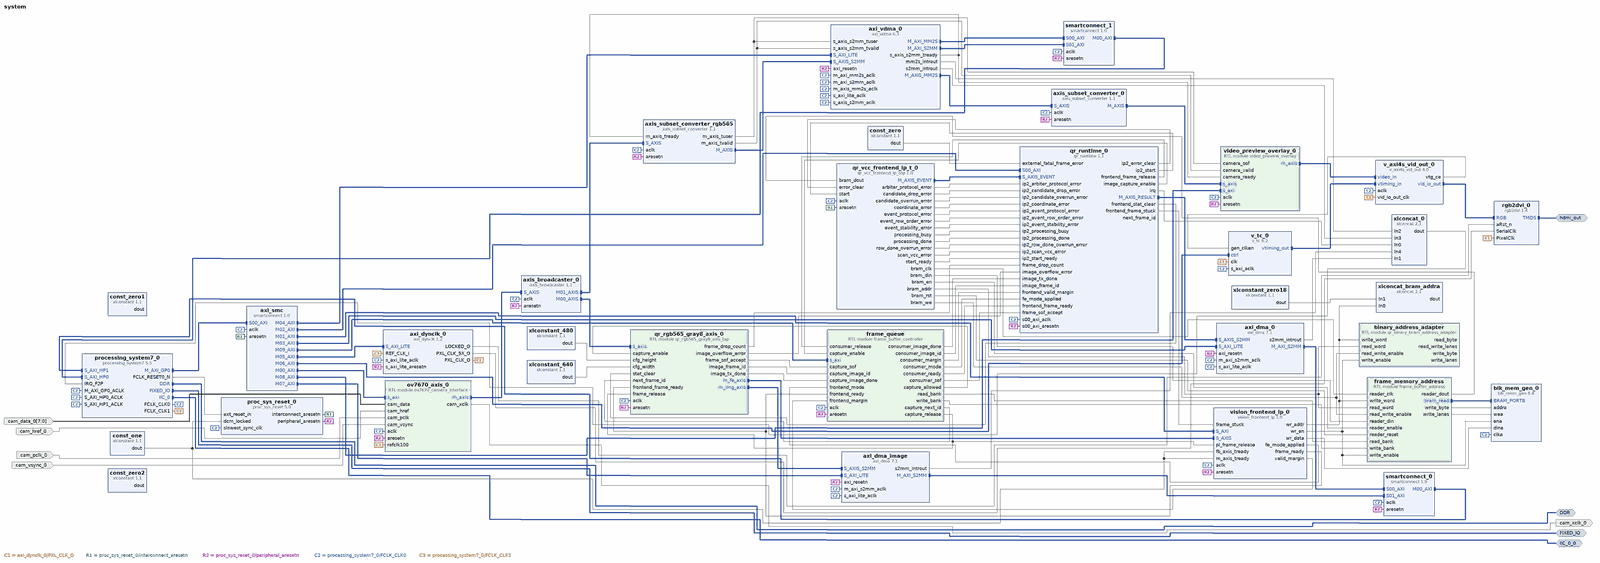
[diagram p0: block diagram of the top level, whole]
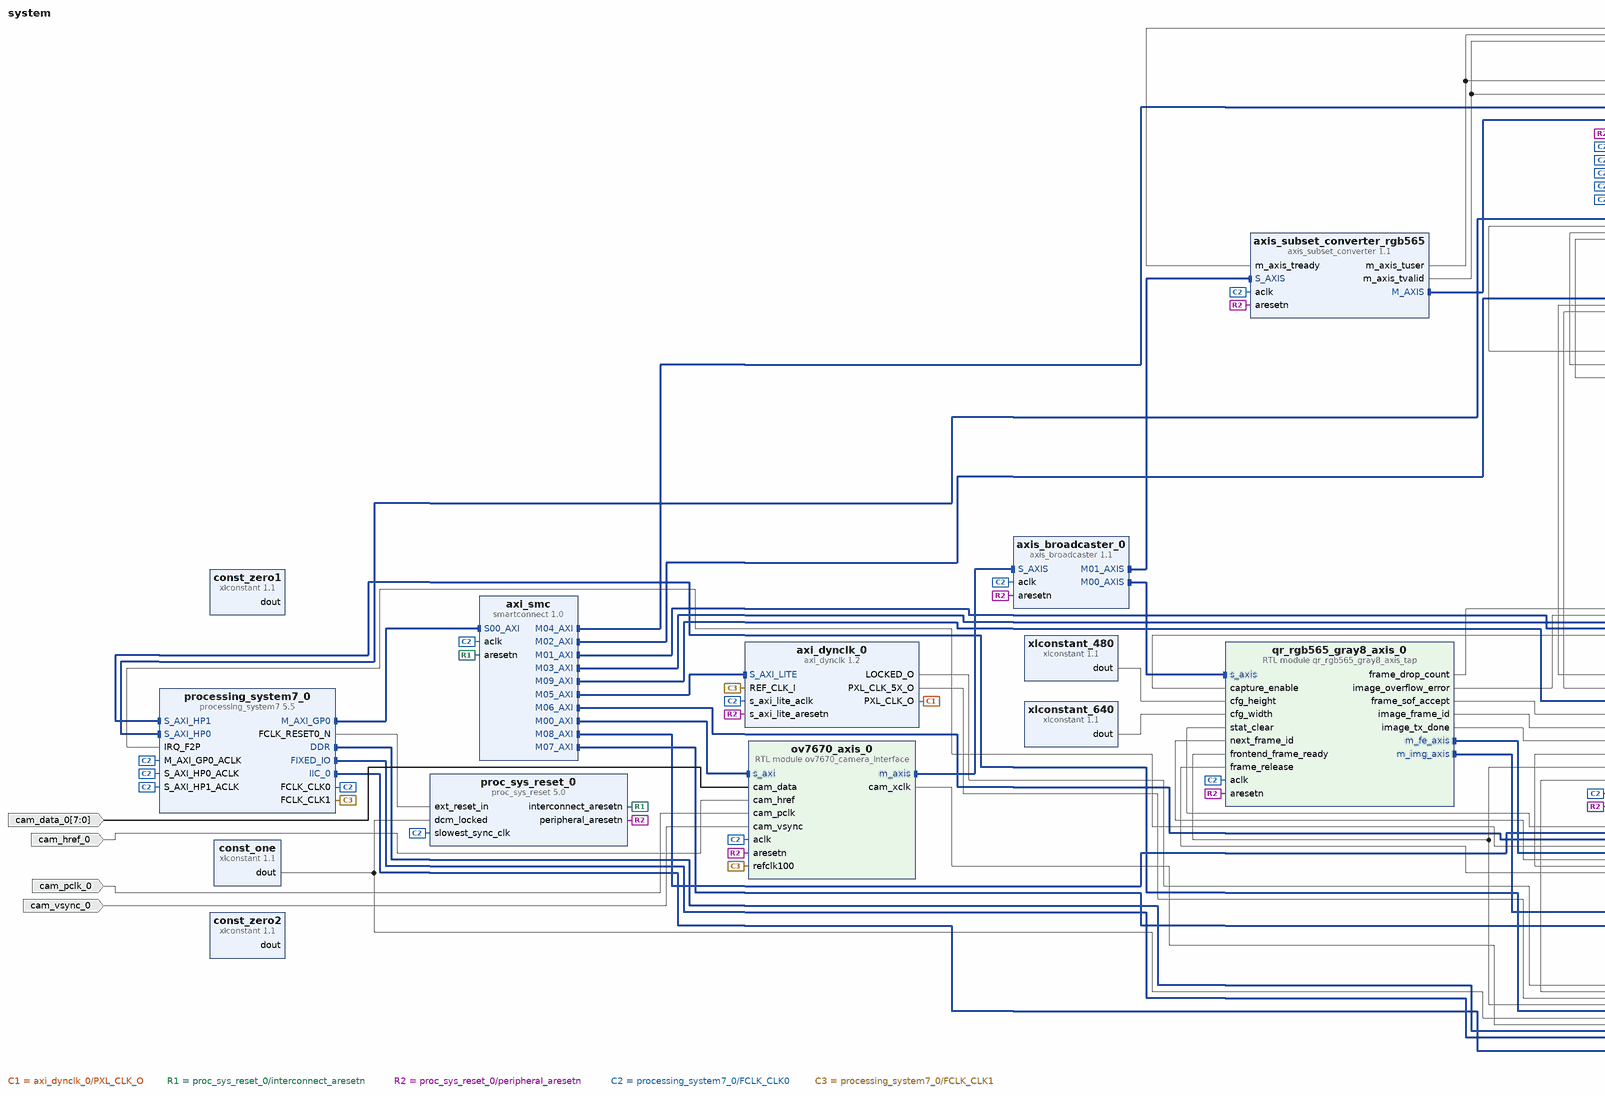
[diagram p1: block diagram of the top level, left part]
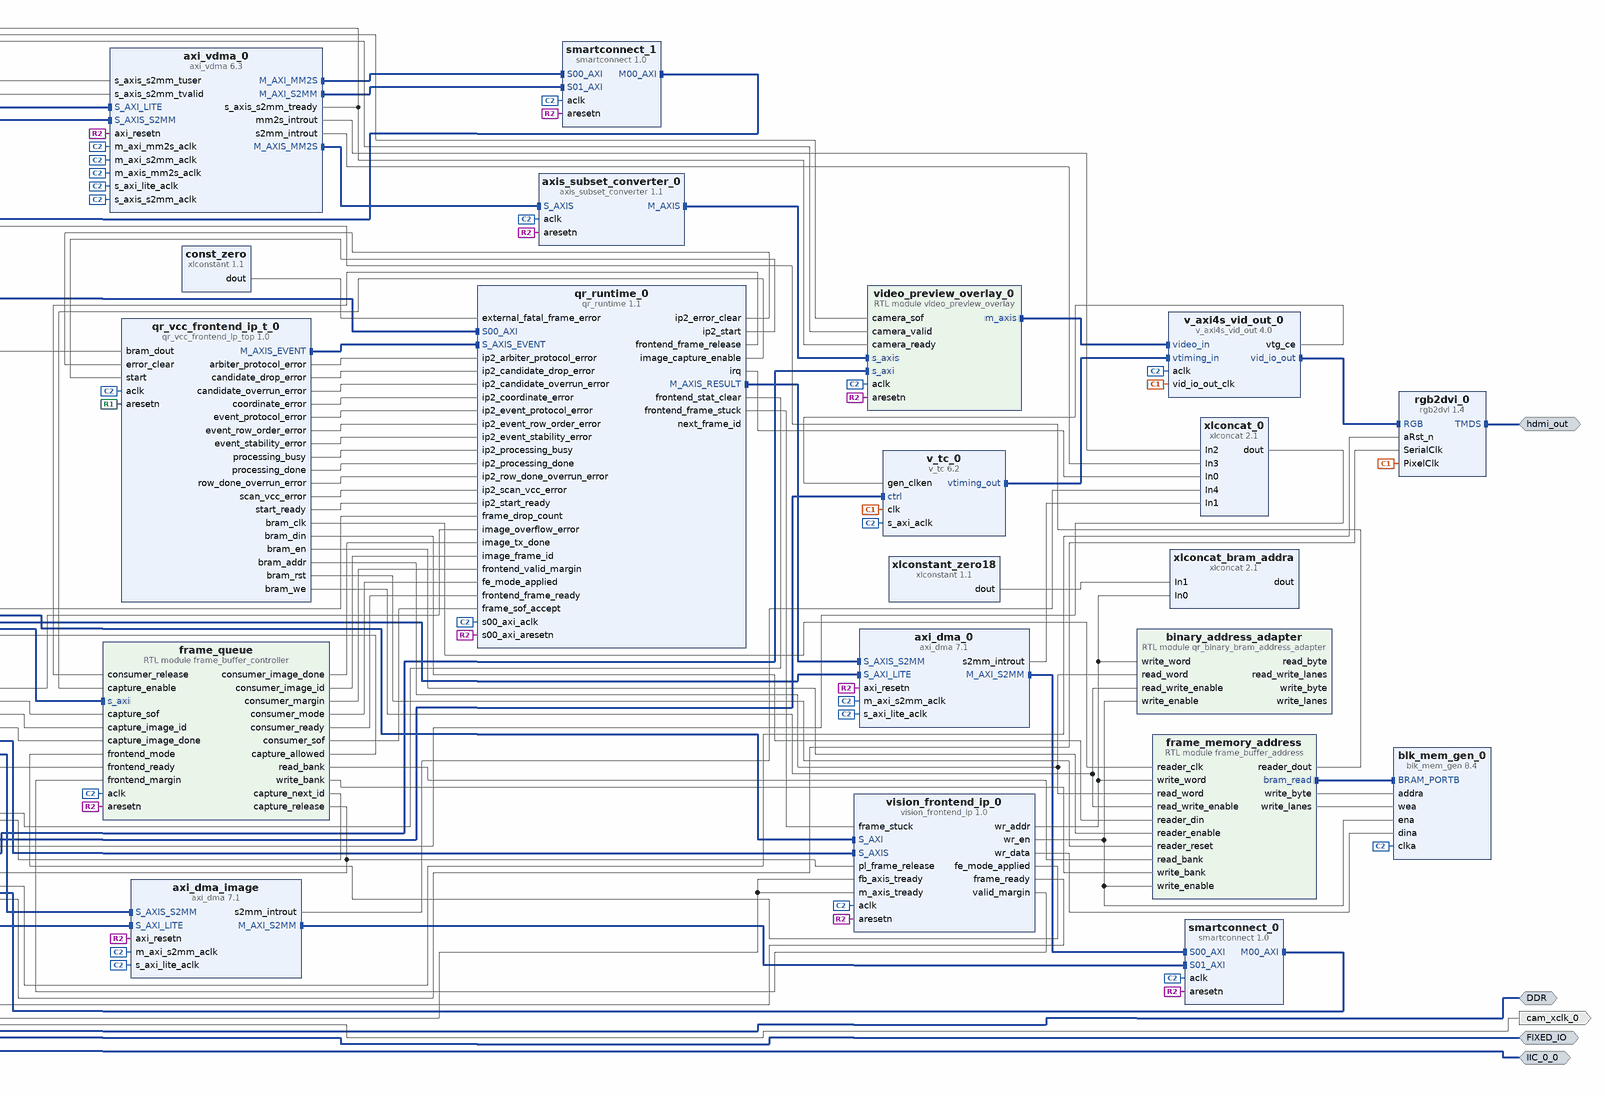
[diagram p2: block diagram of the top level, right part]
# Vivado block design system, xc7z020clg400-1, Vivado 2024.2
create_bd_design system

create_bd_intf_port -mode Master -vlnv xilinx.com:interface:ddrx_rtl:1.0 DDR
create_bd_intf_port -mode Master -vlnv xilinx.com:display_processing_system7:fixedio_rtl:1.0 FIXED_IO
create_bd_intf_port -mode Master -vlnv xilinx.com:interface:iic_rtl:1.0 IIC_0_0
create_bd_intf_port -mode Master -vlnv digilentinc.com:interface:tmds_rtl:1.0 hdmi_out
create_bd_port -dir I cam_pclk_0
create_bd_port -dir I cam_href_0
create_bd_port -dir I cam_vsync_0
create_bd_port -dir I -from 7 -to 0 cam_data_0
create_bd_port -dir O cam_xclk_0

create_bd_cell -type ip -vlnv xilinx.com:ip:processing_system7:5.5 processing_system7_0
set_property -dict [list \
  CONFIG.PCW_APU_PERIPHERAL_FREQMHZ 666.666666 \
  CONFIG.PCW_ENET0_ENET0_IO {MIO 16 .. 27} \
  CONFIG.PCW_ENET0_GRP_MDIO_ENABLE 1 \
  CONFIG.PCW_ENET0_GRP_MDIO_IO {MIO 52 .. 53} \
  CONFIG.PCW_ENET0_PERIPHERAL_ENABLE 1 \
  CONFIG.PCW_ENET0_RESET_ENABLE 0 \
  CONFIG.PCW_ENET_RESET_ENABLE 1 \
  CONFIG.PCW_ENET_RESET_SELECT {Share reset pin} \
  CONFIG.PCW_EN_CLK1_PORT 1 \
  CONFIG.PCW_FCLK_CLK1_BUF TRUE \
  CONFIG.PCW_FPGA0_PERIPHERAL_FREQMHZ 62.500000 \
  CONFIG.PCW_FPGA1_PERIPHERAL_FREQMHZ 100.000000 \
  CONFIG.PCW_FPGA_FCLK1_ENABLE 1 \
  CONFIG.PCW_GPIO_MIO_GPIO_ENABLE 1 \
  CONFIG.PCW_GPIO_MIO_GPIO_IO MIO \
  CONFIG.PCW_I2C0_I2C0_IO EMIO \
  CONFIG.PCW_I2C0_PERIPHERAL_ENABLE 1 \
  CONFIG.PCW_I2C_PERIPHERAL_FREQMHZ 111.111115 \
  CONFIG.PCW_I2C_RESET_ENABLE 1 \
  CONFIG.PCW_I2C_RESET_SELECT {Share reset pin} \
  CONFIG.PCW_IRQ_F2P_INTR 1 \
  CONFIG.PCW_PRESET_BANK1_VOLTAGE {LVCMOS 1.8V} \
  CONFIG.PCW_QSPI_GRP_FBCLK_ENABLE 1 \
  CONFIG.PCW_QSPI_GRP_FBCLK_IO {MIO 8} \
  CONFIG.PCW_QSPI_GRP_SINGLE_SS_ENABLE 1 \
  CONFIG.PCW_QSPI_GRP_SINGLE_SS_IO {MIO 1 .. 6} \
  CONFIG.PCW_QSPI_PERIPHERAL_ENABLE 1 \
  CONFIG.PCW_QSPI_QSPI_IO {MIO 1 .. 6} \
  CONFIG.PCW_SD0_GRP_CD_ENABLE 1 \
  CONFIG.PCW_SD0_GRP_CD_IO {MIO 47} \
  CONFIG.PCW_SD0_GRP_WP_ENABLE 0 \
  CONFIG.PCW_SD0_PERIPHERAL_ENABLE 1 \
  CONFIG.PCW_SD0_SD0_IO {MIO 40 .. 45} \
  CONFIG.PCW_SDIO_PERIPHERAL_FREQMHZ 50 \
  CONFIG.PCW_SINGLE_QSPI_DATA_MODE x4 \
  CONFIG.PCW_UART1_PERIPHERAL_ENABLE 1 \
  CONFIG.PCW_UART1_UART1_IO {MIO 48 .. 49} \
  CONFIG.PCW_UART_PERIPHERAL_FREQMHZ 100 \
  CONFIG.PCW_UIPARAM_DDR_FREQ_MHZ 533.333333 \
  CONFIG.PCW_UIPARAM_DDR_MEMORY_TYPE {DDR 3 (Low Voltage)} \
  CONFIG.PCW_UIPARAM_DDR_PARTNO {MT41K256M16 RE-125} \
  CONFIG.PCW_USB0_PERIPHERAL_ENABLE 1 \
  CONFIG.PCW_USB0_RESET_ENABLE 1 \
  CONFIG.PCW_USB0_RESET_IO {MIO 46} \
  CONFIG.PCW_USB0_USB0_IO {MIO 28 .. 39} \
  CONFIG.PCW_USB_RESET_ENABLE 1 \
  CONFIG.PCW_USB_RESET_SELECT {Share reset pin} \
  CONFIG.PCW_USE_FABRIC_INTERRUPT 1 \
  CONFIG.PCW_USE_S_AXI_HP0 1 \
  CONFIG.PCW_USE_S_AXI_HP1 1 \
] [get_bd_cells processing_system7_0]
# 299 more settings of processing_system7_0 are not shown: defaults, MIO pin electricals, DDR timing, and values the tool derives
create_bd_cell -type ip -vlnv xilinx.com:ip:smartconnect:1.0 axi_smc
set_property -dict {CONFIG.NUM_CLKS 1 CONFIG.NUM_MI 10 CONFIG.NUM_SI 1} [get_bd_cells axi_smc]
create_bd_cell -type ip -vlnv xilinx.com:ip:proc_sys_reset:5.0 proc_sys_reset_0
create_bd_cell -type ip -vlnv xilinx.com:user:vision_frontend_ip:1.0 vision_frontend_ip_0
create_bd_cell -type ip -vlnv xilinx.com:ip:xlconstant:1.1 const_one
set_property -dict {CONFIG.CONST_VAL 1 CONFIG.CONST_WIDTH 1} [get_bd_cells const_one]
create_bd_cell -type ip -vlnv xilinx.com:ip:xlconstant:1.1 const_zero
set_property -dict {CONFIG.CONST_VAL 0 CONFIG.CONST_WIDTH 1} [get_bd_cells const_zero]
create_bd_cell -type ip -vlnv xilinx.com:ip:blk_mem_gen:8.4 blk_mem_gen_0
set_property -dict [list \
  CONFIG.Assume_Synchronous_Clk true \
  CONFIG.Enable_32bit_Address true \
  CONFIG.Memory_Type True_Dual_Port_RAM \
  CONFIG.Read_Width_A 32 \
  CONFIG.Read_Width_B 32 \
  CONFIG.Register_PortA_Output_of_Memory_Core false \
  CONFIG.Register_PortA_Output_of_Memory_Primitives false \
  CONFIG.Register_PortB_Output_of_Memory_Core false \
  CONFIG.Register_PortB_Output_of_Memory_Primitives false \
  CONFIG.Use_RSTA_Pin true \
  CONFIG.Use_RSTB_Pin true \
  CONFIG.Write_Width_A 32 \
  CONFIG.Write_Width_B 32 \
  CONFIG.use_bram_block BRAM_Controller \
] [get_bd_cells blk_mem_gen_0]
create_bd_cell -type ip -vlnv user.org:user:qr_vcc_frontend_ip_top:1.0 qr_vcc_frontend_ip_t_0
create_bd_cell -type ip -vlnv xilinx.com:ip:xlconcat:2.1 xlconcat_0
set_property -dict {CONFIG.IN0_WIDTH 1 CONFIG.NUM_PORTS 5} [get_bd_cells xlconcat_0]
create_bd_cell -type ip -vlnv xilinx.com:ip:xlconcat:2.1 xlconcat_bram_addra
set_property -dict {CONFIG.IN0_WIDTH 14 CONFIG.IN1_WIDTH 18 CONFIG.NUM_PORTS 2} [get_bd_cells xlconcat_bram_addra]
create_bd_cell -type ip -vlnv xilinx.com:ip:xlconstant:1.1 xlconstant_zero18
set_property -dict {CONFIG.CONST_VAL 0 CONFIG.CONST_WIDTH 18} [get_bd_cells xlconstant_zero18]
create_bd_cell -type ip -vlnv xilinx.com:ip:axi_dma:7.1 axi_dma_0
set_property -dict {CONFIG.c_include_mm2s 0 CONFIG.c_include_sg 0} [get_bd_cells axi_dma_0]
create_bd_cell -type ip -vlnv xilinx.com:ip:smartconnect:1.0 smartconnect_0
set_property -dict {CONFIG.NUM_SI 2} [get_bd_cells smartconnect_0]
create_bd_cell -type ip -vlnv xilinx.com:ip:axi_vdma:6.3 axi_vdma_0
set_property -dict [list \
  CONFIG.c_m_axis_mm2s_tdata_width 24 \
  CONFIG.c_mm2s_linebuffer_depth 2048 \
  CONFIG.c_mm2s_max_burst_length 32 \
  CONFIG.c_num_fstores 4 \
  CONFIG.c_s2mm_linebuffer_depth 2048 \
  CONFIG.c_s2mm_max_burst_length 32 \
] [get_bd_cells axi_vdma_0]
create_bd_cell -type ip -vlnv xilinx.com:ip:smartconnect:1.0 smartconnect_1
create_bd_cell -type ip -vlnv digilentinc.com:ip:axi_dynclk:1.2 axi_dynclk_0
create_bd_cell -type ip -vlnv xilinx.com:ip:axis_subset_converter:1.1 axis_subset_converter_0
set_property -dict [list \
  CONFIG.M_HAS_TKEEP 1 \
  CONFIG.M_HAS_TLAST 1 \
  CONFIG.M_HAS_TREADY 1 \
  CONFIG.M_HAS_TSTRB 0 \
  CONFIG.M_TDATA_NUM_BYTES 3 \
  CONFIG.M_TDEST_WIDTH 0 \
  CONFIG.M_TID_WIDTH 0 \
  CONFIG.M_TUSER_WIDTH 1 \
  CONFIG.S_HAS_TKEEP 1 \
  CONFIG.S_HAS_TLAST 1 \
  CONFIG.S_HAS_TREADY 1 \
  CONFIG.S_HAS_TSTRB 0 \
  CONFIG.S_TDATA_NUM_BYTES 3 \
  CONFIG.S_TDEST_WIDTH 0 \
  CONFIG.S_TID_WIDTH 0 \
  CONFIG.S_TUSER_WIDTH 1 \
] [get_bd_cells axis_subset_converter_0]
create_bd_cell -type ip -vlnv xilinx.com:ip:v_axi4s_vid_out:4.0 v_axi4s_vid_out_0
set_property -dict {CONFIG.C_HAS_ASYNC_CLK 1} [get_bd_cells v_axi4s_vid_out_0]
create_bd_cell -type ip -vlnv xilinx.com:ip:v_tc:6.2 v_tc_0
create_bd_cell -type ip -vlnv digilentinc.com:ip:rgb2dvi:1.4 rgb2dvi_0
set_property -dict {CONFIG.kGenerateSerialClk false CONFIG.kRstActiveHigh false} [get_bd_cells rgb2dvi_0]
create_bd_cell -type ip -vlnv xilinx.com:ip:axis_broadcaster:1.1 axis_broadcaster_0
set_property -dict [list \
  CONFIG.HAS_TKEEP 0 \
  CONFIG.HAS_TLAST 1 \
  CONFIG.HAS_TREADY 1 \
  CONFIG.HAS_TSTRB 1 \
  CONFIG.M_TDATA_NUM_BYTES 2 \
  CONFIG.M_TUSER_WIDTH 1 \
  CONFIG.S_TDATA_NUM_BYTES 2 \
  CONFIG.S_TUSER_WIDTH 1 \
  CONFIG.TDEST_WIDTH 0 \
  CONFIG.TID_WIDTH 0 \
] [get_bd_cells axis_broadcaster_0]
create_bd_cell -type ip -vlnv xilinx.com:ip:axis_subset_converter:1.1 axis_subset_converter_rgb565
set_property -dict [list \
  CONFIG.M_HAS_TKEEP 0 \
  CONFIG.M_HAS_TLAST 1 \
  CONFIG.M_HAS_TREADY 1 \
  CONFIG.M_HAS_TSTRB 1 \
  CONFIG.M_TDATA_NUM_BYTES 3 \
  CONFIG.M_TDEST_WIDTH 0 \
  CONFIG.M_TID_WIDTH 0 \
  CONFIG.M_TUSER_WIDTH 1 \
  CONFIG.S_HAS_TKEEP 0 \
  CONFIG.S_HAS_TLAST 1 \
  CONFIG.S_HAS_TREADY 1 \
  CONFIG.S_HAS_TSTRB 1 \
  CONFIG.S_TDATA_NUM_BYTES 2 \
  CONFIG.S_TDEST_WIDTH 0 \
  CONFIG.S_TID_WIDTH 0 \
  CONFIG.S_TUSER_WIDTH 1 \
  CONFIG.TDATA_REMAP {tdata[15:11],tdata[15:13],tdata[10:5],tdata[10:9],tdata[4:0],tdata[4:2]} \
  CONFIG.TSTRB_REMAP {1'b1,tstrb[1:0]} \
] [get_bd_cells axis_subset_converter_rgb565]
create_bd_cell -type ip -vlnv user.org:user:qr_runtime:1.1 qr_runtime_0
create_bd_cell -type module -reference qr_rgb565_gray8_axis_tap qr_rgb565_gray8_axis_0
create_bd_cell -type ip -vlnv xilinx.com:ip:xlconstant:1.1 xlconstant_640
set_property -dict {CONFIG.CONST_VAL 640 CONFIG.CONST_WIDTH 12} [get_bd_cells xlconstant_640]
create_bd_cell -type ip -vlnv xilinx.com:ip:xlconstant:1.1 xlconstant_480
set_property -dict {CONFIG.CONST_VAL 480 CONFIG.CONST_WIDTH 12} [get_bd_cells xlconstant_480]
create_bd_cell -type ip -vlnv xilinx.com:ip:axi_dma:7.1 axi_dma_image
set_property -dict [list \
  CONFIG.c_include_mm2s 0 \
  CONFIG.c_include_s2mm 1 \
  CONFIG.c_include_sg 0 \
  CONFIG.c_sg_length_width 23 \
] [get_bd_cells axi_dma_image]
create_bd_cell -type ip -vlnv xilinx.com:ip:xlconstant:1.1 const_zero1
set_property -dict {CONFIG.CONST_VAL 0 CONFIG.CONST_WIDTH 16} [get_bd_cells const_zero1]
create_bd_cell -type ip -vlnv xilinx.com:ip:xlconstant:1.1 const_zero2
set_property -dict {CONFIG.CONST_VAL 0 CONFIG.CONST_WIDTH 6} [get_bd_cells const_zero2]
create_bd_cell -type module -reference video_preview_overlay video_preview_overlay_0
create_bd_cell -type module -reference ov7670_camera_interface ov7670_axis_0
create_bd_cell -type module -reference qr_binary_bram_address_adapter binary_address_adapter
create_bd_cell -type module -reference frame_buffer_controller frame_queue
create_bd_cell -type module -reference frame_buffer_address frame_memory_address

# ---- connections ----

connect_bd_intf_net [get_bd_intf_pins axi_dma_0/M_AXI_S2MM] [get_bd_intf_pins smartconnect_0/S00_AXI]
connect_bd_intf_net [get_bd_intf_pins smartconnect_0/S01_AXI] [get_bd_intf_pins axi_dma_image/M_AXI_S2MM]
connect_bd_intf_net [get_bd_intf_pins axi_smc/M00_AXI] [get_bd_intf_pins ov7670_axis_0/s_axi]
connect_bd_intf_net [get_bd_intf_pins axi_smc/M01_AXI] [get_bd_intf_pins vision_frontend_ip_0/S_AXI]
connect_bd_intf_net [get_bd_intf_pins axi_smc/M02_AXI] [get_bd_intf_pins qr_runtime_0/S00_AXI]
connect_bd_intf_net [get_bd_intf_pins axi_dma_0/S_AXI_LITE] [get_bd_intf_pins axi_smc/M03_AXI]
connect_bd_intf_net [get_bd_intf_pins axi_smc/M04_AXI] [get_bd_intf_pins axi_vdma_0/S_AXI_LITE]
connect_bd_intf_net [get_bd_intf_pins axi_smc/M05_AXI] [get_bd_intf_pins axi_dynclk_0/S_AXI_LITE]
connect_bd_intf_net [get_bd_intf_pins axi_smc/M06_AXI] [get_bd_intf_pins v_tc_0/ctrl]
connect_bd_intf_net [get_bd_intf_pins axi_smc/M07_AXI] [get_bd_intf_pins axi_dma_image/S_AXI_LITE]
connect_bd_intf_net [get_bd_intf_pins axi_smc/M08_AXI] [get_bd_intf_pins video_preview_overlay_0/s_axi]
connect_bd_intf_net [get_bd_intf_pins axi_smc/M09_AXI] [get_bd_intf_pins frame_queue/s_axi]
connect_bd_intf_net [get_bd_intf_pins axis_subset_converter_0/S_AXIS] [get_bd_intf_pins axi_vdma_0/M_AXIS_MM2S]
connect_bd_intf_net [get_bd_intf_pins axi_vdma_0/M_AXI_MM2S] [get_bd_intf_pins smartconnect_1/S00_AXI]
connect_bd_intf_net [get_bd_intf_pins axi_vdma_0/M_AXI_S2MM] [get_bd_intf_pins smartconnect_1/S01_AXI]
connect_bd_intf_net [get_bd_intf_pins axis_broadcaster_0/M00_AXIS] [get_bd_intf_pins qr_rgb565_gray8_axis_0/s_axis]
connect_bd_intf_net [get_bd_intf_pins axis_broadcaster_0/M01_AXIS] [get_bd_intf_pins axis_subset_converter_rgb565/S_AXIS]
connect_bd_intf_net [get_bd_intf_pins axis_subset_converter_0/M_AXIS] [get_bd_intf_pins video_preview_overlay_0/s_axis]
connect_bd_intf_net [get_bd_intf_pins axis_subset_converter_rgb565/M_AXIS] [get_bd_intf_pins axi_vdma_0/S_AXIS_S2MM]
connect_bd_intf_net [get_bd_intf_pins frame_memory_address/bram_read] [get_bd_intf_pins blk_mem_gen_0/BRAM_PORTB]
connect_bd_intf_net -intf_net ov7670_axis_0_M00_AXIS [get_bd_intf_pins ov7670_axis_0/m_axis] [get_bd_intf_pins axis_broadcaster_0/S_AXIS]
connect_bd_intf_net [get_bd_intf_ports DDR] [get_bd_intf_pins processing_system7_0/DDR]
connect_bd_intf_net [get_bd_intf_ports FIXED_IO] [get_bd_intf_pins processing_system7_0/FIXED_IO]
connect_bd_intf_net [get_bd_intf_ports IIC_0_0] [get_bd_intf_pins processing_system7_0/IIC_0]
connect_bd_intf_net [get_bd_intf_pins processing_system7_0/M_AXI_GP0] [get_bd_intf_pins axi_smc/S00_AXI]
connect_bd_intf_net [get_bd_intf_pins qr_rgb565_gray8_axis_0/m_fe_axis] [get_bd_intf_pins vision_frontend_ip_0/S_AXIS]
connect_bd_intf_net [get_bd_intf_pins qr_rgb565_gray8_axis_0/m_img_axis] [get_bd_intf_pins axi_dma_image/S_AXIS_S2MM]
connect_bd_intf_net [get_bd_intf_pins qr_runtime_0/M_AXIS_RESULT] [get_bd_intf_pins axi_dma_0/S_AXIS_S2MM]
connect_bd_intf_net [get_bd_intf_pins qr_vcc_frontend_ip_t_0/M_AXIS_EVENT] [get_bd_intf_pins qr_runtime_0/S_AXIS_EVENT]
connect_bd_intf_net [get_bd_intf_ports hdmi_out] [get_bd_intf_pins rgb2dvi_0/TMDS]
connect_bd_intf_net [get_bd_intf_pins smartconnect_0/M00_AXI] [get_bd_intf_pins processing_system7_0/S_AXI_HP1]
connect_bd_intf_net [get_bd_intf_pins smartconnect_1/M00_AXI] [get_bd_intf_pins processing_system7_0/S_AXI_HP0]
connect_bd_intf_net [get_bd_intf_pins v_axi4s_vid_out_0/vid_io_out] [get_bd_intf_pins rgb2dvi_0/RGB]
connect_bd_intf_net [get_bd_intf_pins v_tc_0/vtiming_out] [get_bd_intf_pins v_axi4s_vid_out_0/vtiming_in]
connect_bd_intf_net [get_bd_intf_pins video_preview_overlay_0/m_axis] [get_bd_intf_pins v_axi4s_vid_out_0/video_in]
connect_bd_net [get_bd_pins axi_dma_0/s2mm_introut] [get_bd_pins xlconcat_0/In1]
connect_bd_net [get_bd_pins axi_dma_image/s2mm_introut] [get_bd_pins xlconcat_0/In4]
connect_bd_net [get_bd_pins axi_dynclk_0/LOCKED_O] [get_bd_pins rgb2dvi_0/aRst_n]
connect_bd_net [get_bd_pins axi_dynclk_0/PXL_CLK_5X_O] [get_bd_pins rgb2dvi_0/SerialClk]
connect_bd_net [get_bd_pins axi_dynclk_0/PXL_CLK_O] \
  [get_bd_pins v_tc_0/clk] [get_bd_pins rgb2dvi_0/PixelClk] [get_bd_pins v_axi4s_vid_out_0/vid_io_out_clk]
connect_bd_net [get_bd_pins axi_vdma_0/mm2s_introut] [get_bd_pins xlconcat_0/In2]
connect_bd_net [get_bd_pins axi_vdma_0/s2mm_introut] [get_bd_pins xlconcat_0/In3]
connect_bd_net [get_bd_pins axi_vdma_0/s_axis_s2mm_tready] \
  [get_bd_pins axis_subset_converter_rgb565/m_axis_tready] [get_bd_pins video_preview_overlay_0/camera_ready]
connect_bd_net [get_bd_pins axis_subset_converter_rgb565/m_axis_tuser] \
  [get_bd_pins axi_vdma_0/s_axis_s2mm_tuser] [get_bd_pins video_preview_overlay_0/camera_sof]
connect_bd_net [get_bd_pins axis_subset_converter_rgb565/m_axis_tvalid] \
  [get_bd_pins axi_vdma_0/s_axis_s2mm_tvalid] [get_bd_pins video_preview_overlay_0/camera_valid]
# net binary_address_adapter_read_byte has one end: binary_address_adapter/read_byte
# net binary_address_adapter_read_write_lanes has one end: binary_address_adapter/read_write_lanes
# net binary_address_adapter_write_byte has one end: binary_address_adapter/write_byte
# net binary_address_adapter_write_lanes has one end: binary_address_adapter/write_lanes
connect_bd_net [get_bd_pins frame_memory_address/reader_dout] [get_bd_pins qr_vcc_frontend_ip_t_0/bram_dout]
connect_bd_net [get_bd_pins frame_memory_address/write_byte] [get_bd_pins blk_mem_gen_0/addra]
connect_bd_net [get_bd_pins frame_memory_address/write_lanes] [get_bd_pins blk_mem_gen_0/wea]
connect_bd_net -net cam_data_0_1 [get_bd_ports cam_data_0] [get_bd_pins ov7670_axis_0/cam_data]
connect_bd_net -net cam_href_0_1 [get_bd_ports cam_href_0] [get_bd_pins ov7670_axis_0/cam_href]
connect_bd_net -net cam_pclk_0_1 [get_bd_ports cam_pclk_0] [get_bd_pins ov7670_axis_0/cam_pclk]
connect_bd_net -net cam_vsync_0_1 [get_bd_ports cam_vsync_0] [get_bd_pins ov7670_axis_0/cam_vsync]
connect_bd_net [get_bd_pins const_one/dout] \
  [get_bd_pins proc_sys_reset_0/dcm_locked] [get_bd_pins vision_frontend_ip_0/fb_axis_tready] \
  [get_bd_pins vision_frontend_ip_0/m_axis_tready]
# net const_zero1_dout has one end: const_zero1/dout
connect_bd_net -net const_zero2_dout [get_bd_pins xlconstant_zero18/dout] [get_bd_pins xlconcat_bram_addra/In1]
# net const_zero2_dout1 has one end: const_zero2/dout
connect_bd_net [get_bd_pins const_zero/dout] [get_bd_pins qr_runtime_0/external_fatal_frame_error]
connect_bd_net [get_bd_pins frame_queue/capture_allowed] [get_bd_pins qr_rgb565_gray8_axis_0/capture_enable]
connect_bd_net [get_bd_pins frame_queue/capture_next_id] [get_bd_pins qr_rgb565_gray8_axis_0/next_frame_id]
connect_bd_net [get_bd_pins frame_queue/capture_release] \
  [get_bd_pins qr_rgb565_gray8_axis_0/frame_release] [get_bd_pins vision_frontend_ip_0/pl_frame_release]
connect_bd_net [get_bd_pins frame_queue/consumer_image_done] [get_bd_pins qr_runtime_0/image_tx_done]
connect_bd_net [get_bd_pins frame_queue/consumer_image_id] [get_bd_pins qr_runtime_0/image_frame_id]
connect_bd_net [get_bd_pins frame_queue/consumer_margin] [get_bd_pins qr_runtime_0/frontend_valid_margin]
connect_bd_net [get_bd_pins frame_queue/consumer_mode] [get_bd_pins qr_runtime_0/fe_mode_applied]
connect_bd_net [get_bd_pins frame_queue/consumer_ready] [get_bd_pins qr_runtime_0/frontend_frame_ready]
connect_bd_net [get_bd_pins frame_queue/consumer_sof] [get_bd_pins qr_runtime_0/frame_sof_accept]
connect_bd_net [get_bd_pins frame_queue/read_bank] [get_bd_pins frame_memory_address/read_bank]
connect_bd_net [get_bd_pins frame_queue/write_bank] [get_bd_pins frame_memory_address/write_bank]
connect_bd_net [get_bd_pins ov7670_axis_0/cam_xclk] [get_bd_ports cam_xclk_0]
connect_bd_net [get_bd_pins proc_sys_reset_0/interconnect_aresetn] [get_bd_pins axi_smc/aresetn] [get_bd_pins qr_vcc_frontend_ip_t_0/aresetn]
connect_bd_net [get_bd_pins proc_sys_reset_0/peripheral_aresetn] \
  [get_bd_pins axi_dma_0/axi_resetn] [get_bd_pins smartconnect_0/aresetn] [get_bd_pins axi_vdma_0/axi_resetn] \
  [get_bd_pins smartconnect_1/aresetn] [get_bd_pins axi_dynclk_0/s_axi_lite_aresetn] \
  [get_bd_pins axis_subset_converter_0/aresetn] [get_bd_pins axis_broadcaster_0/aresetn] \
  [get_bd_pins axis_subset_converter_rgb565/aresetn] [get_bd_pins vision_frontend_ip_0/aresetn] \
  [get_bd_pins qr_runtime_0/s00_axi_aresetn] [get_bd_pins qr_rgb565_gray8_axis_0/aresetn] \
  [get_bd_pins axi_dma_image/axi_resetn] [get_bd_pins video_preview_overlay_0/aresetn] [get_bd_pins ov7670_axis_0/aresetn] \
  [get_bd_pins frame_queue/aresetn]
connect_bd_net [get_bd_pins processing_system7_0/FCLK_CLK0] \
  [get_bd_pins processing_system7_0/M_AXI_GP0_ACLK] [get_bd_pins axi_smc/aclk] \
  [get_bd_pins proc_sys_reset_0/slowest_sync_clk] [get_bd_pins blk_mem_gen_0/clka] [get_bd_pins axi_dma_0/s_axi_lite_aclk] \
  [get_bd_pins axi_dma_0/m_axi_s2mm_aclk] [get_bd_pins smartconnect_0/aclk] [get_bd_pins processing_system7_0/S_AXI_HP1_ACLK] \
  [get_bd_pins axi_vdma_0/s_axi_lite_aclk] [get_bd_pins axi_vdma_0/m_axi_mm2s_aclk] [get_bd_pins axi_vdma_0/m_axi_s2mm_aclk] \
  [get_bd_pins smartconnect_1/aclk] [get_bd_pins processing_system7_0/S_AXI_HP0_ACLK] \
  [get_bd_pins axi_vdma_0/m_axis_mm2s_aclk] [get_bd_pins axi_vdma_0/s_axis_s2mm_aclk] \
  [get_bd_pins axi_dynclk_0/s_axi_lite_aclk] [get_bd_pins v_tc_0/s_axi_aclk] [get_bd_pins axis_subset_converter_0/aclk] \
  [get_bd_pins v_axi4s_vid_out_0/aclk] [get_bd_pins axis_broadcaster_0/aclk] [get_bd_pins axis_subset_converter_rgb565/aclk] \
  [get_bd_pins vision_frontend_ip_0/aclk] [get_bd_pins qr_vcc_frontend_ip_t_0/aclk] [get_bd_pins qr_runtime_0/s00_axi_aclk] \
  [get_bd_pins qr_rgb565_gray8_axis_0/aclk] [get_bd_pins axi_dma_image/s_axi_lite_aclk] \
  [get_bd_pins axi_dma_image/m_axi_s2mm_aclk] [get_bd_pins video_preview_overlay_0/aclk] [get_bd_pins ov7670_axis_0/aclk] \
  [get_bd_pins frame_queue/aclk]
connect_bd_net [get_bd_pins processing_system7_0/FCLK_CLK1] [get_bd_pins axi_dynclk_0/REF_CLK_I] [get_bd_pins ov7670_axis_0/refclk100]
connect_bd_net [get_bd_pins processing_system7_0/FCLK_RESET0_N] [get_bd_pins proc_sys_reset_0/ext_reset_in]
connect_bd_net [get_bd_pins qr_rgb565_gray8_axis_0/frame_drop_count] [get_bd_pins qr_runtime_0/frame_drop_count]
connect_bd_net [get_bd_pins qr_rgb565_gray8_axis_0/frame_sof_accept] [get_bd_pins frame_queue/capture_sof]
connect_bd_net [get_bd_pins qr_rgb565_gray8_axis_0/image_frame_id] [get_bd_pins frame_queue/capture_image_id]
connect_bd_net [get_bd_pins qr_rgb565_gray8_axis_0/image_overflow_error] [get_bd_pins qr_runtime_0/image_overflow_error]
connect_bd_net [get_bd_pins qr_rgb565_gray8_axis_0/image_tx_done] [get_bd_pins frame_queue/capture_image_done]
connect_bd_net [get_bd_pins qr_runtime_0/frontend_frame_release] [get_bd_pins frame_queue/consumer_release]
connect_bd_net [get_bd_pins qr_runtime_0/frontend_frame_stuck] [get_bd_pins vision_frontend_ip_0/frame_stuck]
connect_bd_net [get_bd_pins qr_runtime_0/frontend_stat_clear] [get_bd_pins qr_rgb565_gray8_axis_0/stat_clear]
connect_bd_net [get_bd_pins qr_runtime_0/image_capture_enable] [get_bd_pins frame_queue/capture_enable]
connect_bd_net [get_bd_pins qr_runtime_0/ip2_error_clear] [get_bd_pins qr_vcc_frontend_ip_t_0/error_clear]
connect_bd_net [get_bd_pins qr_runtime_0/ip2_start] [get_bd_pins qr_vcc_frontend_ip_t_0/start]
connect_bd_net [get_bd_pins qr_runtime_0/irq] [get_bd_pins xlconcat_0/In0]
# net qr_runtime_0_next_frame_id has one end: qr_runtime_0/next_frame_id
connect_bd_net [get_bd_pins qr_vcc_frontend_ip_t_0/arbiter_protocol_error] [get_bd_pins qr_runtime_0/ip2_arbiter_protocol_error]
connect_bd_net [get_bd_pins qr_vcc_frontend_ip_t_0/bram_addr] \
  [get_bd_pins binary_address_adapter/read_word] [get_bd_pins frame_memory_address/read_word]
connect_bd_net [get_bd_pins qr_vcc_frontend_ip_t_0/bram_clk] [get_bd_pins frame_memory_address/reader_clk]
connect_bd_net [get_bd_pins qr_vcc_frontend_ip_t_0/bram_din] [get_bd_pins frame_memory_address/reader_din]
connect_bd_net [get_bd_pins qr_vcc_frontend_ip_t_0/bram_en] [get_bd_pins frame_memory_address/reader_enable]
connect_bd_net [get_bd_pins qr_vcc_frontend_ip_t_0/bram_rst] [get_bd_pins frame_memory_address/reader_reset]
connect_bd_net [get_bd_pins qr_vcc_frontend_ip_t_0/bram_we] \
  [get_bd_pins binary_address_adapter/read_write_enable] [get_bd_pins frame_memory_address/read_write_enable]
connect_bd_net [get_bd_pins qr_vcc_frontend_ip_t_0/candidate_drop_error] [get_bd_pins qr_runtime_0/ip2_candidate_drop_error]
connect_bd_net [get_bd_pins qr_vcc_frontend_ip_t_0/candidate_overrun_error] [get_bd_pins qr_runtime_0/ip2_candidate_overrun_error]
connect_bd_net [get_bd_pins qr_vcc_frontend_ip_t_0/coordinate_error] [get_bd_pins qr_runtime_0/ip2_coordinate_error]
connect_bd_net [get_bd_pins qr_vcc_frontend_ip_t_0/event_protocol_error] [get_bd_pins qr_runtime_0/ip2_event_protocol_error]
connect_bd_net [get_bd_pins qr_vcc_frontend_ip_t_0/event_row_order_error] [get_bd_pins qr_runtime_0/ip2_event_row_order_error]
connect_bd_net [get_bd_pins qr_vcc_frontend_ip_t_0/event_stability_error] [get_bd_pins qr_runtime_0/ip2_event_stability_error]
connect_bd_net [get_bd_pins qr_vcc_frontend_ip_t_0/processing_busy] [get_bd_pins qr_runtime_0/ip2_processing_busy]
connect_bd_net [get_bd_pins qr_vcc_frontend_ip_t_0/processing_done] [get_bd_pins qr_runtime_0/ip2_processing_done]
connect_bd_net [get_bd_pins qr_vcc_frontend_ip_t_0/row_done_overrun_error] [get_bd_pins qr_runtime_0/ip2_row_done_overrun_error]
connect_bd_net [get_bd_pins qr_vcc_frontend_ip_t_0/scan_vcc_error] [get_bd_pins qr_runtime_0/ip2_scan_vcc_error]
connect_bd_net [get_bd_pins qr_vcc_frontend_ip_t_0/start_ready] [get_bd_pins qr_runtime_0/ip2_start_ready]
connect_bd_net [get_bd_pins v_axi4s_vid_out_0/vtg_ce] [get_bd_pins v_tc_0/gen_clken]
connect_bd_net [get_bd_pins vision_frontend_ip_0/fe_mode_applied] [get_bd_pins frame_queue/frontend_mode]
connect_bd_net [get_bd_pins vision_frontend_ip_0/frame_ready] \
  [get_bd_pins qr_rgb565_gray8_axis_0/frontend_frame_ready] [get_bd_pins frame_queue/frontend_ready]
connect_bd_net [get_bd_pins vision_frontend_ip_0/valid_margin] [get_bd_pins frame_queue/frontend_margin]
connect_bd_net [get_bd_pins vision_frontend_ip_0/wr_addr] \
  [get_bd_pins xlconcat_bram_addra/In0] [get_bd_pins binary_address_adapter/write_word] \
  [get_bd_pins frame_memory_address/write_word]
connect_bd_net [get_bd_pins vision_frontend_ip_0/wr_data] [get_bd_pins blk_mem_gen_0/dina]
connect_bd_net [get_bd_pins vision_frontend_ip_0/wr_en] \
  [get_bd_pins blk_mem_gen_0/ena] [get_bd_pins binary_address_adapter/write_enable] \
  [get_bd_pins frame_memory_address/write_enable]
connect_bd_net [get_bd_pins xlconcat_0/dout] [get_bd_pins processing_system7_0/IRQ_F2P]
# net xlconcat_1_dout has one end: xlconcat_bram_addra/dout
connect_bd_net -net xlconstant_0_dout [get_bd_pins xlconstant_480/dout] [get_bd_pins qr_rgb565_gray8_axis_0/cfg_height]
connect_bd_net [get_bd_pins xlconstant_640/dout] [get_bd_pins qr_rgb565_gray8_axis_0/cfg_width]

# ---- address map ----
assign_bd_address -offset 0x00000000 -range 1G -target_address_space [get_bd_addr_spaces axi_dma_0/Data_S2MM] [get_bd_addr_segs processing_system7_0/S_AXI_HP1/HP1_DDR_LOWOCM]
assign_bd_address -offset 0x00000000 -range 1G -target_address_space [get_bd_addr_spaces axi_dma_image/Data_S2MM] [get_bd_addr_segs processing_system7_0/S_AXI_HP1/HP1_DDR_LOWOCM]
assign_bd_address -offset 0x00000000 -range 1G -target_address_space [get_bd_addr_spaces axi_vdma_0/Data_MM2S] [get_bd_addr_segs processing_system7_0/S_AXI_HP0/HP0_DDR_LOWOCM]
assign_bd_address -offset 0x00000000 -range 1G -target_address_space [get_bd_addr_spaces axi_vdma_0/Data_S2MM] [get_bd_addr_segs processing_system7_0/S_AXI_HP0/HP0_DDR_LOWOCM]
assign_bd_address -offset 0x40000000 -range 4K -target_address_space [get_bd_addr_spaces processing_system7_0/Data] [get_bd_addr_segs vision_frontend_ip_0/S_AXI/reg0]
assign_bd_address -offset 0x40010000 -range 64K -target_address_space [get_bd_addr_spaces processing_system7_0/Data] [get_bd_addr_segs ov7670_axis_0/s_axi/reg0]
assign_bd_address -offset 0x40400000 -range 64K -target_address_space [get_bd_addr_spaces processing_system7_0/Data] [get_bd_addr_segs axi_dma_0/S_AXI_LITE/Reg]
assign_bd_address -offset 0x40410000 -range 64K -target_address_space [get_bd_addr_spaces processing_system7_0/Data] [get_bd_addr_segs axi_dma_image/S_AXI_LITE/Reg]
assign_bd_address -offset 0x43000000 -range 64K -target_address_space [get_bd_addr_spaces processing_system7_0/Data] [get_bd_addr_segs axi_vdma_0/S_AXI_LITE/Reg]
assign_bd_address -offset 0x43C00000 -range 64K -target_address_space [get_bd_addr_spaces processing_system7_0/Data] [get_bd_addr_segs axi_dynclk_0/S_AXI_LITE/S_AXI_LITE_reg]
assign_bd_address -offset 0x43C10000 -range 64K -target_address_space [get_bd_addr_spaces processing_system7_0/Data] [get_bd_addr_segs v_tc_0/ctrl/Reg]
assign_bd_address -offset 0x43C20000 -range 64K -target_address_space [get_bd_addr_spaces processing_system7_0/Data] [get_bd_addr_segs qr_runtime_0/S00_AXI/S00_AXI_reg]
assign_bd_address -offset 0x43C30000 -range 32K -target_address_space [get_bd_addr_spaces processing_system7_0/Data] [get_bd_addr_segs video_preview_overlay_0/s_axi/reg0]
assign_bd_address -offset 0x43C40000 -range 64K -target_address_space [get_bd_addr_spaces processing_system7_0/Data] [get_bd_addr_segs frame_queue/s_axi/reg0]

validate_bd_design
save_bd_design
